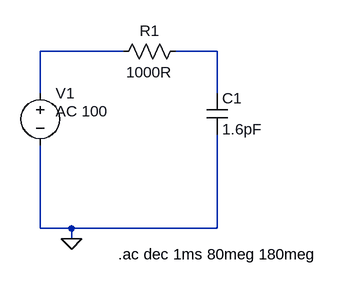
[diagram p0: schematic atividade4-1.asc]
atividade4-1.asc, the LTspice schematic file:
Version 4
SHEET 1 880 680
WIRE 176 -112 48 -112
WIRE 320 -112 256 -112
WIRE 48 -48 48 -112
WIRE 320 -48 320 -112
WIRE 48 160 48 32
WIRE 96 160 48 160
WIRE 320 160 320 16
WIRE 320 160 96 160
WIRE 96 176 96 160
FLAG 96 176 0
SYMBOL voltage 48 -64 R0
WINDOW 123 24 44 Left 2
WINDOW 39 0 0 Left 0
SYMATTR Value2 AC 100
SYMATTR InstName V1
SYMATTR Value ""
SYMBOL res 272 -128 R90
WINDOW 0 0 56 VBottom 2
WINDOW 3 32 56 VTop 2
SYMATTR InstName R1
SYMATTR Value 1000R
SYMBOL cap 304 -48 R0
SYMATTR InstName C1
SYMATTR Value 1.6pF
TEXT 168 200 Left 2 !.ac dec 1ms 80meg 180meg

The netlist it stands for:
* atividade4-1.asc
V1 N001 0 AC 100
R1 N002 N001 1000R
C1 N002 0 1.6pF
.ac dec 1ms 80meg 180meg
.backanno
.end